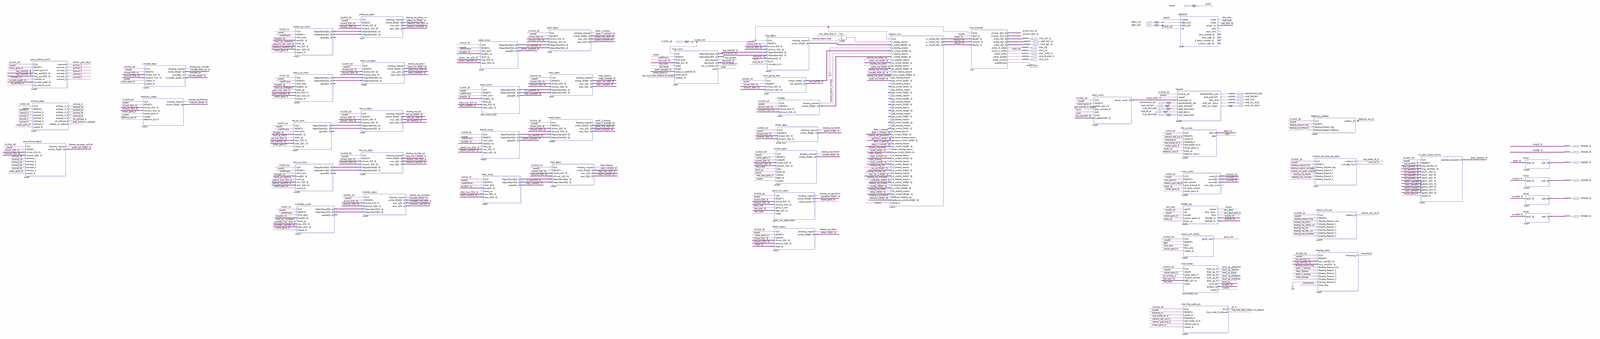
[diagram p0: schematic sheet, whole]
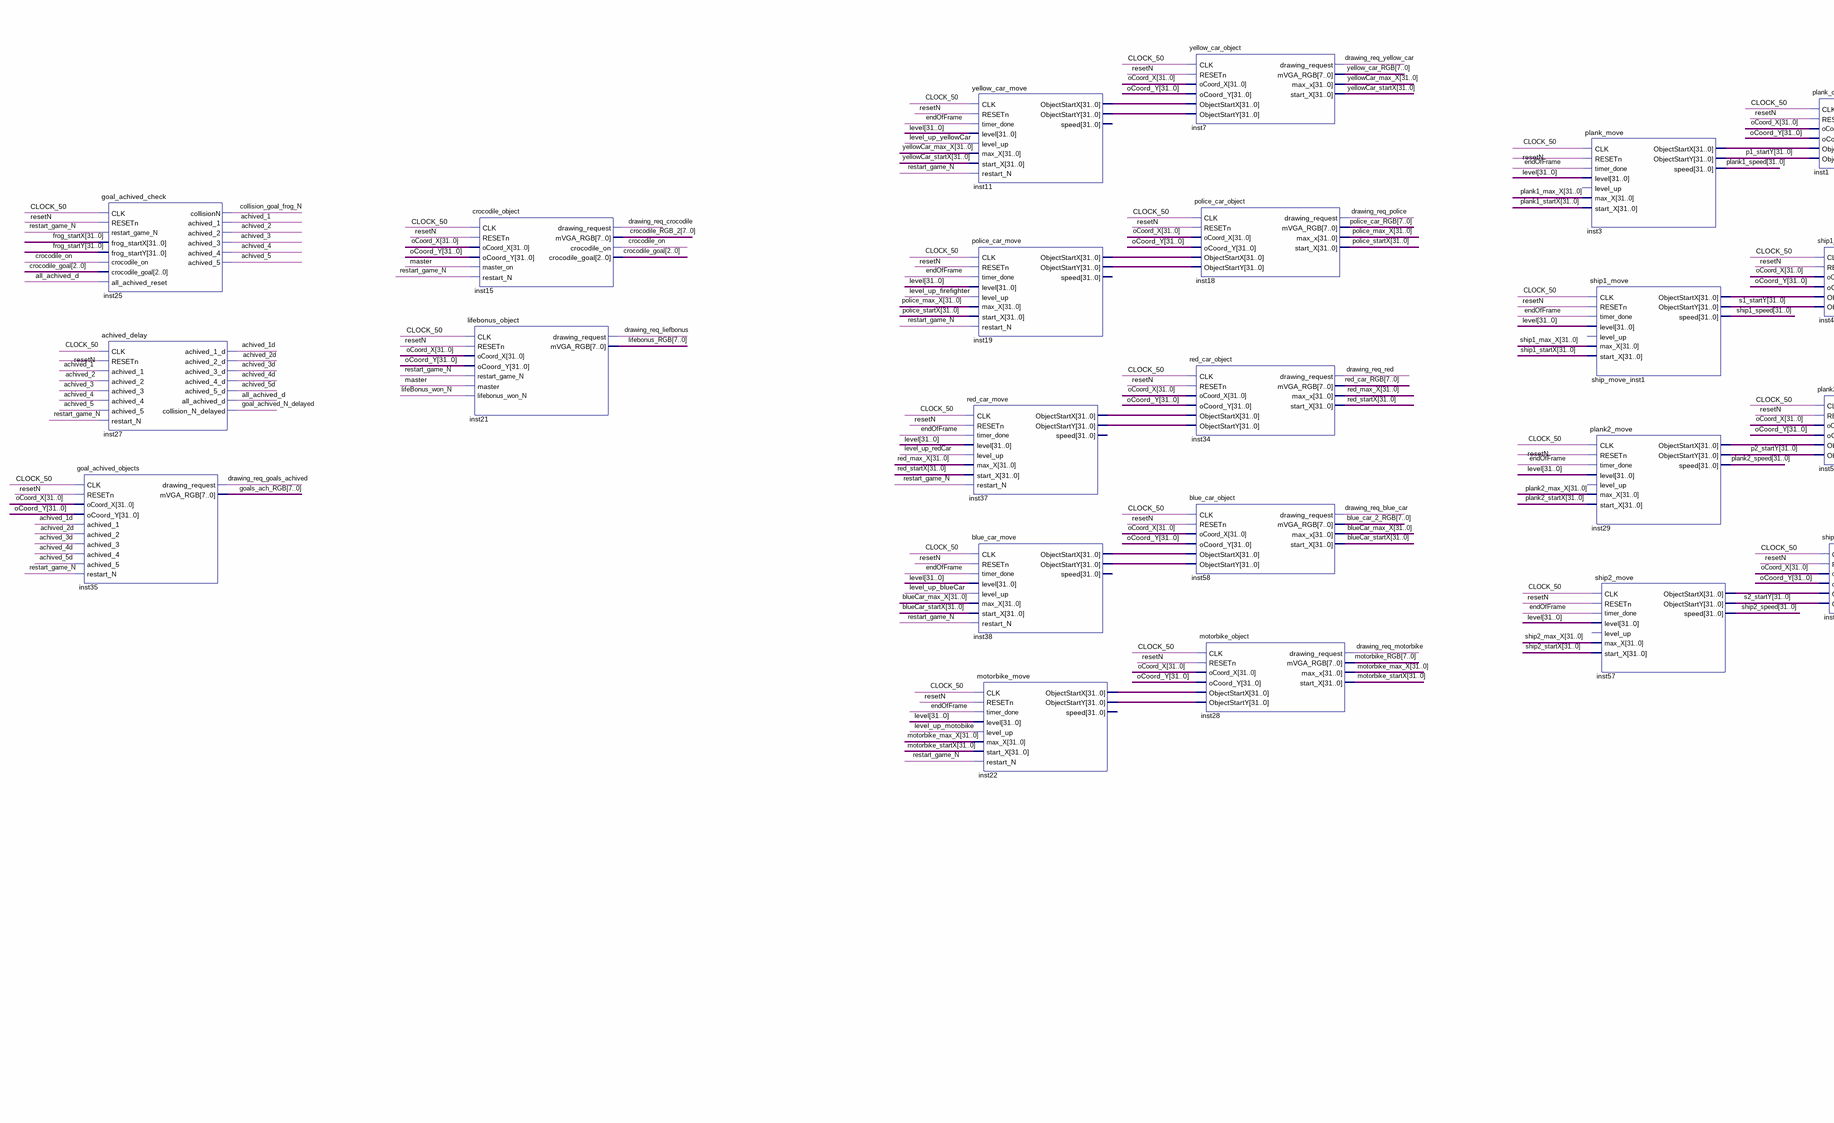
[diagram p1: schematic sheet, left part]
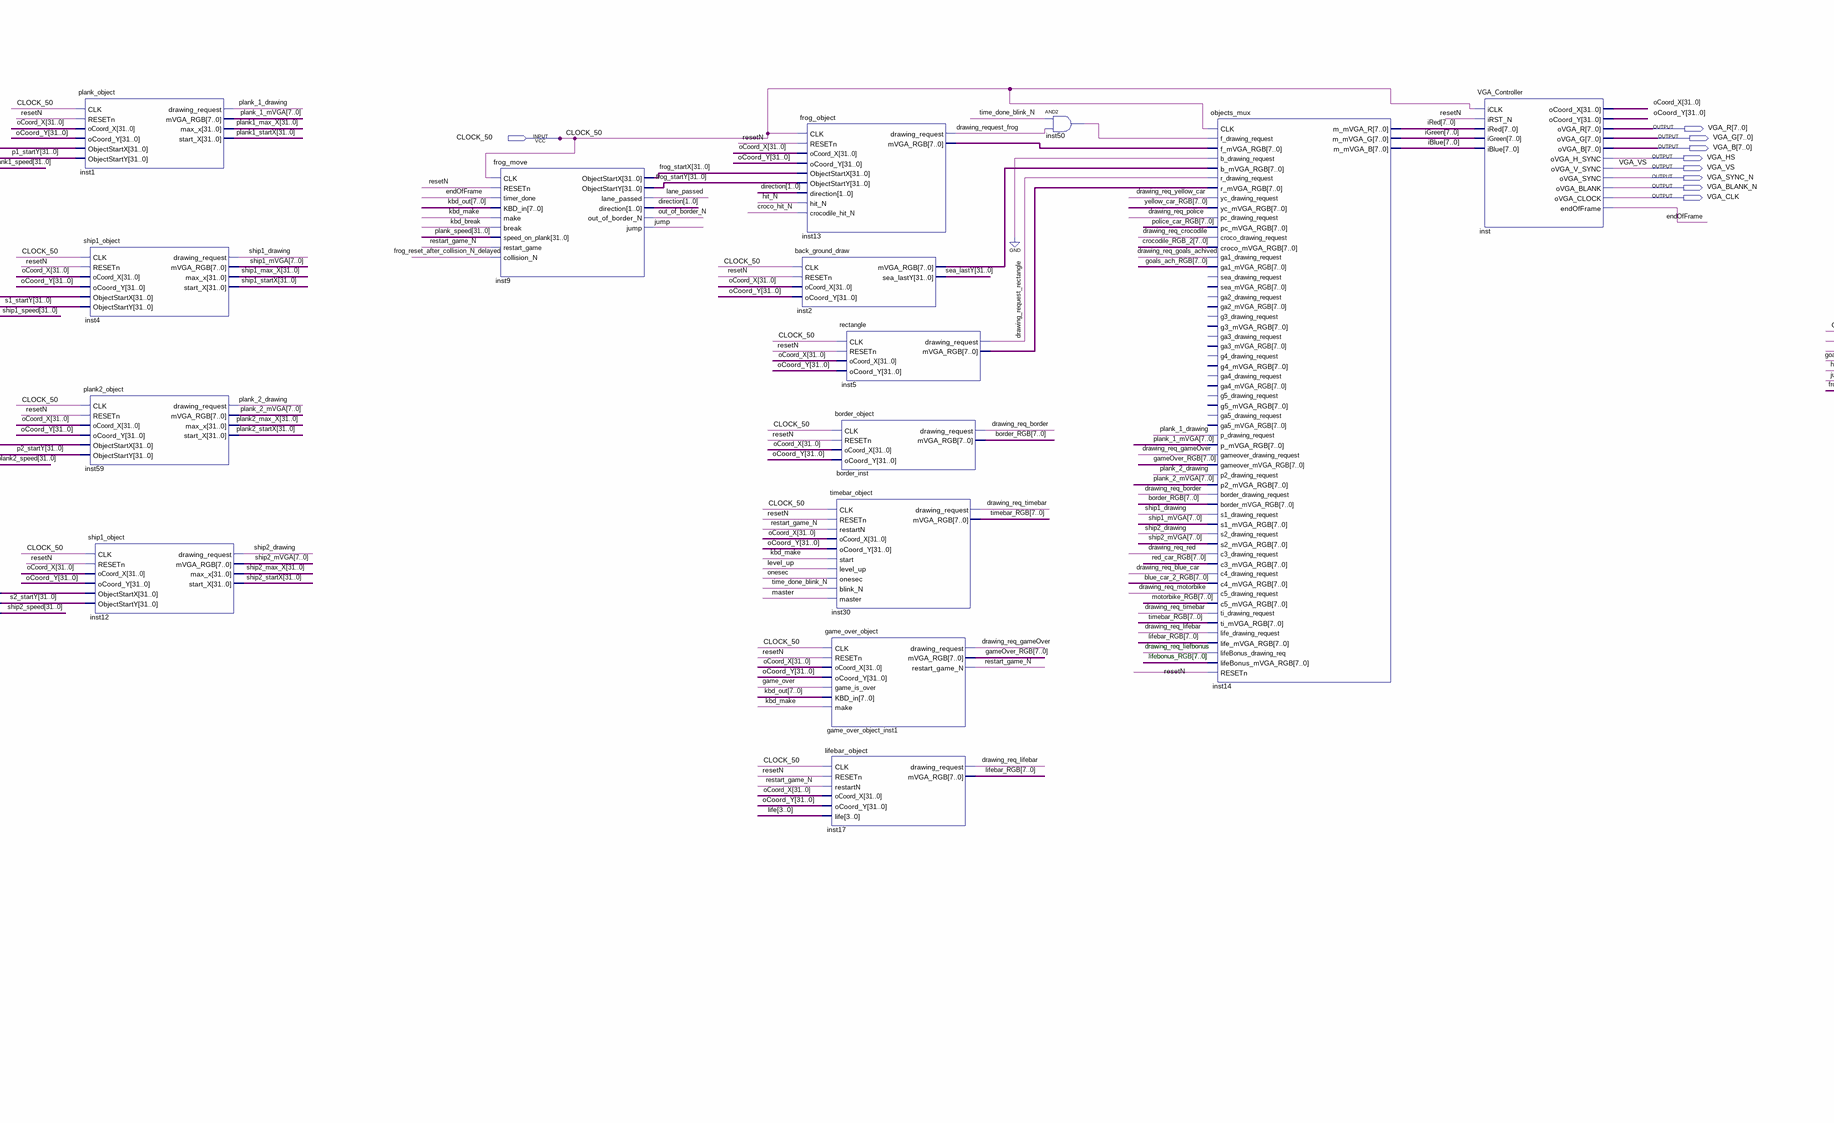
[diagram p2: schematic sheet, centre part]
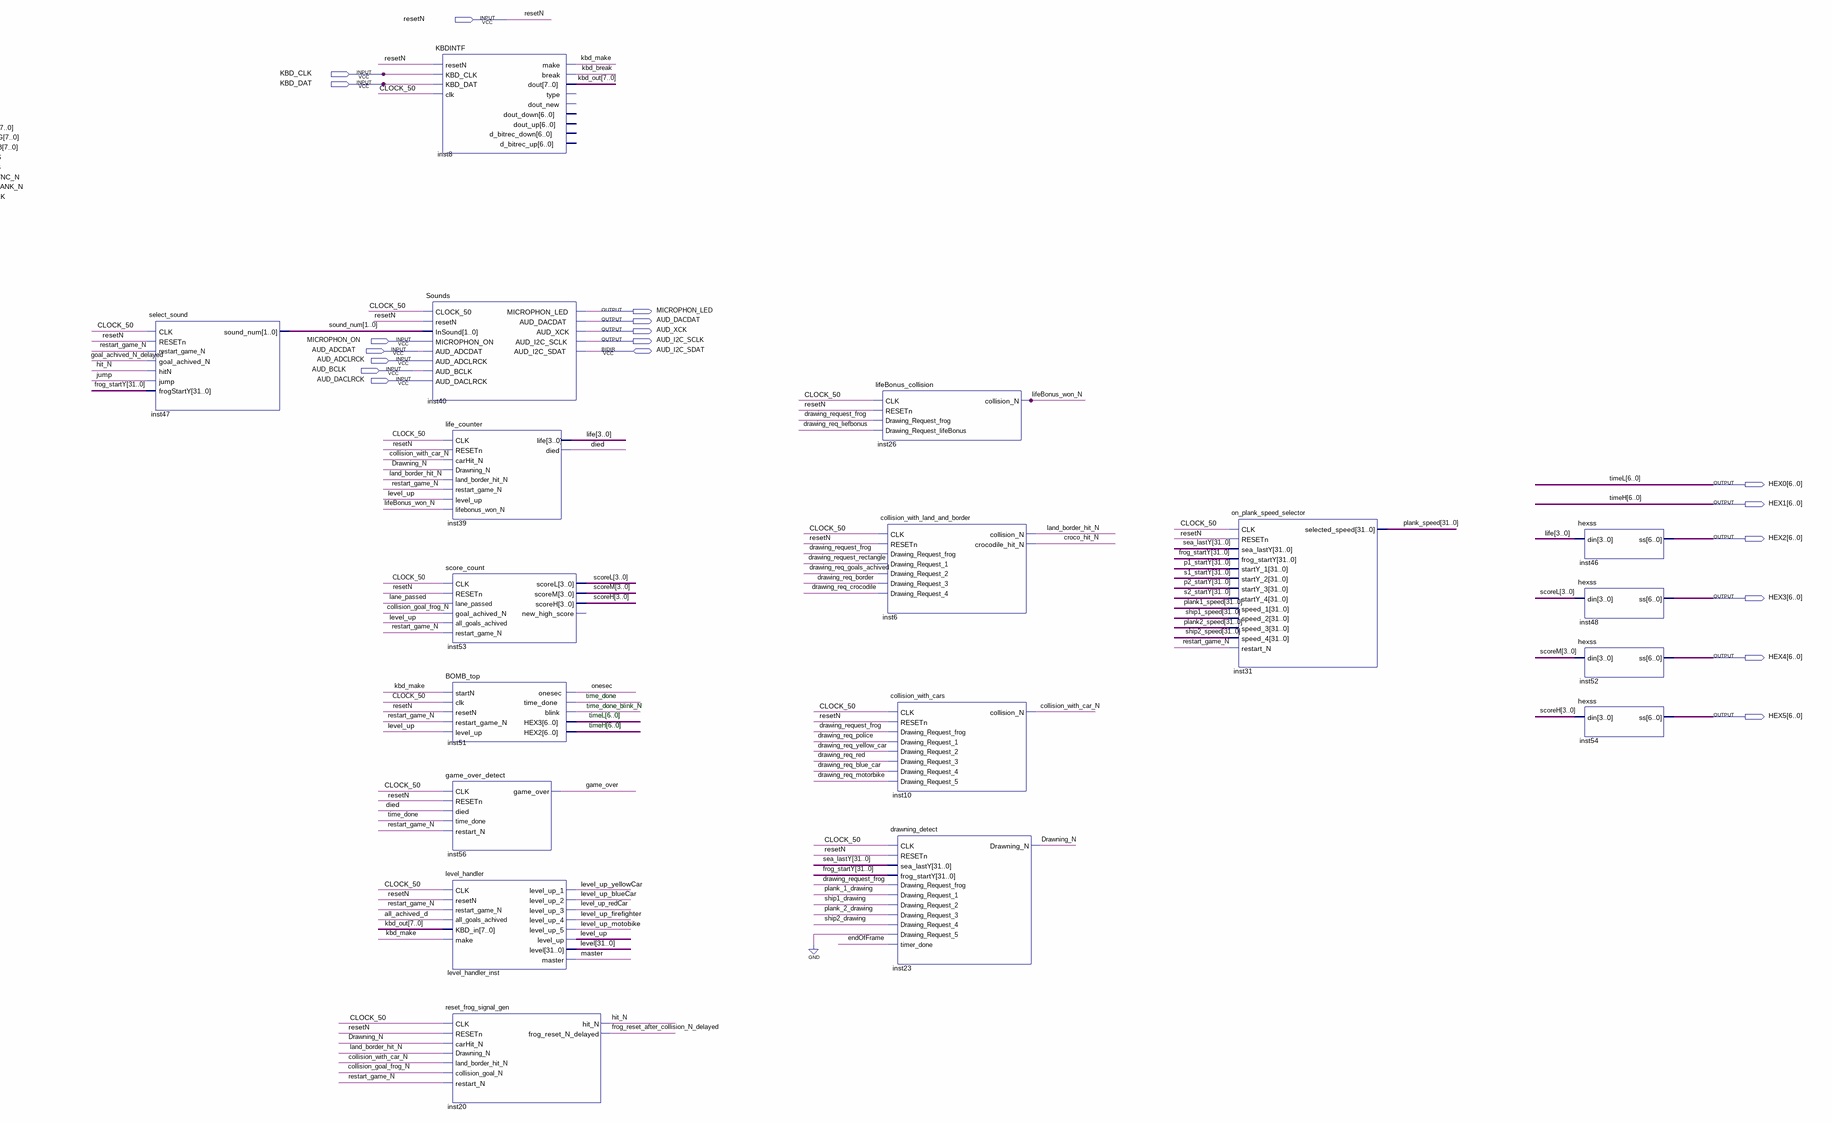
[diagram p3: schematic sheet, right part]
// Quartus schematic TOP_SIFTACH.bdf as structural Verilog: 52 symbols, 28 pins
module TOP_SIFTACH (
  input  resetN,
  input  KBD_CLK,
  input  KBD_DAT,
  input  CLOCK_50,
  input  MICROPHON_ON,
  input  AUD_ADCDAT,
  input  AUD_ADCLRCK,
  input  AUD_BCLK,
  input  AUD_DACLRCK,
  inout  AUD_I2C_SDAT,
  output [7:0] VGA_R,
  output [7:0] VGA_G,
  output [7:0] VGA_B,
  output VGA_HS,
  output VGA_VS,
  output VGA_SYNC_N,
  output VGA_BLANK_N,
  output VGA_CLK,
  output MICROPHON_LED,
  output AUD_DACDAT,
  output AUD_XCK,
  output AUD_I2C_SCLK,
  output [6:0] HEX0,
  output [6:0] HEX1,
  output [6:0] HEX2,
  output [6:0] HEX3,
  output [6:0] HEX4,
  output [6:0] HEX5
);

  wire achived_1, achived_1d, achived_2, achived_2d, achived_3, achived_3d, achived_4, achived_4d, achived_5,
       achived_5d, all_achived_d, collision_goal_frog_N, collision_with_car_N, croco_hit_N, crocodile_on,
       died, drawing_req_blue_car, drawing_req_border, drawing_req_crocodile, drawing_req_gameOver,
       drawing_req_goals_achived, drawing_req_liefbonus, drawing_req_lifebar, drawing_req_motorbike,
       drawing_req_police, drawing_req_red, drawing_req_timebar, drawing_req_yellow_car,
       drawing_request_frog, drawing_request_rectangle, Drawning_N, endOfFrame,
       frog_reset_after_collision_N_delayed, game_over, goal_achived_N_delayed, hit_N, inst50_out, jump,
       kbd_break, kbd_make, land_border_hit_N, lane_passed, level_up, level_up_blueCar, level_up_firefighter,
       level_up_motobike, level_up_redCar, level_up_yellowCar, lifeBonus_won_N, master, onesec,
       out_of_border_N, plank_1_drawing, plank_2_drawing, restart_game_N, ship1_drawing, ship2_drawing,
       time_done, time_done_blink_N;
  wire [1:0] direction, sound_num;
  wire [2:0] crocodile_goal;
  wire [3:0] life, scoreH, scoreL, scoreM;
  wire [7:0] blue_car_2_RGB, border_RGB, crocodile_RGB_2, gameOver_RGB, goals_ach_RGB, iBlue, iGreen,
       inst2_mvga_rgb, inst5_mvga_rgb, inst13_mvga_rgb, iRed, kbd_out, lifebar_RGB, lifebonus_RGB,
       motorbike_RGB, plank_1_mVGA, plank_2_mVGA, police_car_RGB, red_car_RGB, ship1_mVGA, ship2_mVGA,
       timebar_RGB, yellow_car_RGB;
  wire [31:0] blueCar_max_X, blueCar_startX, frog_startX, frog_startY, inst3_objectstartx,
       inst11_objectstartx, inst11_objectstarty, inst19_objectstartx, inst19_objectstarty,
       inst22_objectstartx, inst22_objectstarty, inst29_objectstartx, inst37_objectstartx,
       inst37_objectstarty, inst38_objectstartx, inst38_objectstarty, inst57_objectstartx, level,
       motorbike_max_X, motorbike_startX, oCoord_X, oCoord_Y, p1_startY, p2_startY, plank1_max_X,
       plank1_speed, plank1_startX, plank2_max_X, plank2_speed, plank2_startX, plank_speed, police_max_X,
       police_startX, red_max_X, red_startX, s1_startY, s2_startY, sea_lastY, ship1_max_X, ship1_speed,
       ship1_startX, ship2_max_X, ship2_speed, ship2_startX, ship_move_inst1_objectstartx, yellowCar_max_X,
       yellowCar_startX;

  goal_achived_objects inst35 (
    .CLK(CLOCK_50), .RESETn(resetN), .oCoord_X(oCoord_X), .oCoord_Y(oCoord_Y), .achived_1(achived_1d),
    .achived_2(achived_2d), .achived_3(achived_3d), .achived_4(achived_4d), .achived_5(achived_5d),
    .restart_N(restart_game_N), .drawing_request(drawing_req_goals_achived), .mVGA_RGB(goals_ach_RGB));
  goal_achived_check inst25 (
    .CLK(CLOCK_50), .RESETn(resetN), .restart_game_N(restart_game_N), .frog_startX(frog_startX),
    .frog_startY(frog_startY), .crocodile_on(crocodile_on), .crocodile_goal(crocodile_goal),
    .all_achived_reset(all_achived_d), .achived_1(achived_1), .achived_2(achived_2), .achived_3(achived_3),
    .achived_4(achived_4), .achived_5(achived_5), .collisionN(collision_goal_frog_N));
  achived_delay inst27 (
    .CLK(CLOCK_50), .RESETn(resetN), .achived_1(achived_1), .achived_2(achived_2), .achived_3(achived_3),
    .achived_4(achived_4), .achived_5(achived_5), .restart_N(restart_game_N), .achived_1_d(achived_1d),
    .achived_2_d(achived_2d), .achived_3_d(achived_3d), .achived_4_d(achived_4d), .achived_5_d(achived_5d),
    .all_achived_d(all_achived_d), .collision_N_delayed(goal_achived_N_delayed));
  crocodile_object inst15 (
    .CLK(CLOCK_50), .RESETn(resetN), .oCoord_X(oCoord_X), .oCoord_Y(oCoord_Y), .master_on(master),
    .restart_N(restart_game_N), .drawing_request(drawing_req_crocodile), .mVGA_RGB(crocodile_RGB_2),
    .crocodile_on(crocodile_on), .crocodile_goal(crocodile_goal));
  lifebonus_object inst21 (
    .CLK(CLOCK_50), .RESETn(resetN), .oCoord_X(oCoord_X), .oCoord_Y(oCoord_Y),
    .restart_game_N(restart_game_N), .master(master), .lifebonus_won_N(lifeBonus_won_N),
    .drawing_request(drawing_req_liefbonus), .mVGA_RGB(lifebonus_RGB));
  red_car_move inst37 (
    .CLK(CLOCK_50), .RESETn(resetN), .timer_done(endOfFrame), .level(level), .level_up(level_up_redCar),
    .max_X(red_max_X), .start_X(red_startX), .restart_N(restart_game_N), .ObjectStartX(inst37_objectstartx),
    .ObjectStartY(inst37_objectstarty));  // open: speed
  yellow_car_move inst11 (
    .CLK(CLOCK_50), .RESETn(resetN), .timer_done(endOfFrame), .level(level), .level_up(level_up_yellowCar),
    .max_X(yellowCar_max_X), .start_X(yellowCar_startX), .restart_N(restart_game_N),
    .ObjectStartX(inst11_objectstartx), .ObjectStartY(inst11_objectstarty));  // open: speed
  police_car_move inst19 (
    .CLK(CLOCK_50), .RESETn(resetN), .timer_done(endOfFrame), .level(level), .level_up(level_up_firefighter),
    .max_X(police_max_X), .start_X(police_startX), .restart_N(restart_game_N),
    .ObjectStartX(inst19_objectstartx), .ObjectStartY(inst19_objectstarty));  // open: speed
  blue_car_move inst38 (
    .CLK(CLOCK_50), .RESETn(resetN), .timer_done(endOfFrame), .level(level), .level_up(level_up_blueCar),
    .max_X(blueCar_max_X), .start_X(blueCar_startX), .restart_N(restart_game_N),
    .ObjectStartX(inst38_objectstartx), .ObjectStartY(inst38_objectstarty));  // open: speed
  motorbike_move inst22 (
    .CLK(CLOCK_50), .RESETn(resetN), .timer_done(endOfFrame), .level(level), .level_up(level_up_motobike),
    .max_X(motorbike_max_X), .start_X(motorbike_startX), .restart_N(restart_game_N),
    .ObjectStartX(inst22_objectstartx), .ObjectStartY(inst22_objectstarty));  // open: speed
  yellow_car_object inst7 (
    .CLK(CLOCK_50), .RESETn(resetN), .oCoord_X(oCoord_X), .oCoord_Y(oCoord_Y),
    .ObjectStartX(inst11_objectstartx), .ObjectStartY(inst11_objectstarty),
    .drawing_request(drawing_req_yellow_car), .mVGA_RGB(yellow_car_RGB), .max_x(yellowCar_max_X),
    .start_X(yellowCar_startX));
  police_car_object inst18 (
    .CLK(CLOCK_50), .RESETn(resetN), .oCoord_X(oCoord_X), .oCoord_Y(oCoord_Y),
    .ObjectStartX(inst19_objectstartx), .ObjectStartY(inst19_objectstarty),
    .drawing_request(drawing_req_police), .mVGA_RGB(police_car_RGB), .max_x(police_max_X),
    .start_X(police_startX));
  red_car_object inst34 (
    .CLK(CLOCK_50), .RESETn(resetN), .oCoord_X(oCoord_X), .oCoord_Y(oCoord_Y),
    .ObjectStartX(inst37_objectstartx), .ObjectStartY(inst37_objectstarty),
    .drawing_request(drawing_req_red), .mVGA_RGB(red_car_RGB), .max_x(red_max_X), .start_X(red_startX));
  blue_car_object inst58 (
    .CLK(CLOCK_50), .RESETn(resetN), .oCoord_X(oCoord_X), .oCoord_Y(oCoord_Y),
    .ObjectStartX(inst38_objectstartx), .ObjectStartY(inst38_objectstarty),
    .drawing_request(drawing_req_blue_car), .mVGA_RGB(blue_car_2_RGB), .max_x(blueCar_max_X),
    .start_X(blueCar_startX));
  motorbike_object inst28 (
    .CLK(CLOCK_50), .RESETn(resetN), .oCoord_X(oCoord_X), .oCoord_Y(oCoord_Y),
    .ObjectStartX(inst22_objectstartx), .ObjectStartY(inst22_objectstarty),
    .drawing_request(drawing_req_motorbike), .mVGA_RGB(motorbike_RGB), .max_x(motorbike_max_X),
    .start_X(motorbike_startX));
  plank_move inst3 (
    .CLK(CLOCK_50), .RESETn(resetN), .timer_done(endOfFrame), .level(level), .max_X(plank1_max_X),
    .start_X(plank1_startX), .ObjectStartX(inst3_objectstartx), .ObjectStartY(p1_startY), .speed(plank1_speed));  // open: level_up
  ship1_move ship_move_inst1 (
    .CLK(CLOCK_50), .RESETn(resetN), .timer_done(endOfFrame), .level(level), .max_X(ship1_max_X),
    .start_X(ship1_startX), .ObjectStartX(ship_move_inst1_objectstartx), .ObjectStartY(s1_startY),
    .speed(ship1_speed));  // open: level_up
  plank2_move inst29 (
    .CLK(CLOCK_50), .RESETn(resetN), .timer_done(endOfFrame), .level(level), .max_X(plank2_max_X),
    .start_X(plank2_startX), .ObjectStartX(inst29_objectstartx), .ObjectStartY(p2_startY),
    .speed(plank2_speed));  // open: level_up
  ship2_move inst57 (
    .CLK(CLOCK_50), .RESETn(resetN), .timer_done(endOfFrame), .level(level), .max_X(ship2_max_X),
    .start_X(ship2_startX), .ObjectStartX(inst57_objectstartx), .ObjectStartY(s2_startY), .speed(ship2_speed));  // open: level_up
  plank_object inst1 (
    .CLK(CLOCK_50), .RESETn(resetN), .oCoord_X(oCoord_X), .oCoord_Y(oCoord_Y),
    .ObjectStartX(inst3_objectstartx), .ObjectStartY(p1_startY), .drawing_request(plank_1_drawing),
    .mVGA_RGB(plank_1_mVGA), .max_x(plank1_max_X), .start_X(plank1_startX));
  ship1_object inst4 (
    .CLK(CLOCK_50), .RESETn(resetN), .oCoord_X(oCoord_X), .oCoord_Y(oCoord_Y),
    .ObjectStartX(ship_move_inst1_objectstartx), .ObjectStartY(s1_startY), .drawing_request(ship1_drawing),
    .max_x(ship1_max_X), .start_X(ship1_startX), .mVGA_RGB(ship1_mVGA));
  plank2_object inst59 (
    .CLK(CLOCK_50), .RESETn(resetN), .oCoord_X(oCoord_X), .oCoord_Y(oCoord_Y),
    .ObjectStartX(inst29_objectstartx), .ObjectStartY(p2_startY), .drawing_request(plank_2_drawing),
    .mVGA_RGB(plank_2_mVGA), .max_x(plank2_max_X), .start_X(plank2_startX));
  ship1_object inst12 (
    .CLK(CLOCK_50), .RESETn(resetN), .oCoord_X(oCoord_X), .oCoord_Y(oCoord_Y),
    .ObjectStartX(inst57_objectstartx), .ObjectStartY(s2_startY), .drawing_request(ship2_drawing),
    .max_x(ship2_max_X), .start_X(ship2_startX), .mVGA_RGB(ship2_mVGA));
  frog_move inst9 (
    .CLK(CLOCK_50), .RESETn(resetN), .timer_done(endOfFrame), .KBD_in(kbd_out), .make(kbd_make),
    .\break (kbd_break), .speed_on_plank(plank_speed), .restart_game(restart_game_N),
    .collision_N(frog_reset_after_collision_N_delayed), .ObjectStartX(frog_startX),
    .ObjectStartY(frog_startY), .lane_passed(lane_passed), .direction(direction), .jump(jump),
    .out_of_border_N(out_of_border_N));
  frog_object inst13 (
    .CLK(CLOCK_50), .RESETn(resetN), .oCoord_X(oCoord_X), .oCoord_Y(oCoord_Y), .ObjectStartX(frog_startX),
    .ObjectStartY(frog_startY), .direction(direction), .hit_N(hit_N), .crocodile_hit_N(croco_hit_N),
    .drawing_request(drawing_request_frog), .mVGA_RGB(inst13_mvga_rgb));
  back_ground_draw inst2 (
    .CLK(CLOCK_50), .RESETn(resetN), .oCoord_X(oCoord_X), .oCoord_Y(oCoord_Y), .mVGA_RGB(inst2_mvga_rgb),
    .sea_lastY(sea_lastY));
  rectangle inst5 (
    .CLK(CLOCK_50), .RESETn(resetN), .oCoord_X(oCoord_X), .oCoord_Y(oCoord_Y),
    .drawing_request(drawing_request_rectangle), .mVGA_RGB(inst5_mvga_rgb));
  border_object border_inst (
    .CLK(CLOCK_50), .RESETn(resetN), .oCoord_X(oCoord_X), .oCoord_Y(oCoord_Y),
    .drawing_request(drawing_req_border), .mVGA_RGB(border_RGB));
  timebar_object inst30 (
    .CLK(CLOCK_50), .RESETn(resetN), .restartN(restart_game_N), .oCoord_X(oCoord_X), .oCoord_Y(oCoord_Y),
    .start(kbd_make), .level_up(level_up), .onesec(onesec), .blink_N(time_done_blink_N), .master(master),
    .drawing_request(drawing_req_timebar), .mVGA_RGB(timebar_RGB));
  game_over_object game_over_object_inst1 (
    .CLK(CLOCK_50), .RESETn(resetN), .oCoord_X(oCoord_X), .oCoord_Y(oCoord_Y), .game_is_over(game_over),
    .KBD_in(kbd_out), .make(kbd_make), .drawing_request(drawing_req_gameOver), .mVGA_RGB(gameOver_RGB),
    .restart_game_N(restart_game_N));
  lifebar_object inst17 (
    .CLK(CLOCK_50), .RESETn(resetN), .restartN(restart_game_N), .oCoord_X(oCoord_X), .oCoord_Y(oCoord_Y),
    .life(life), .drawing_request(drawing_req_lifebar), .mVGA_RGB(lifebar_RGB));
  and inst50 (inst50_out, time_done_blink_N, drawing_request_frog);
  objects_mux inst14 (
    .CLK(CLOCK_50), .f_drawing_request(inst50_out), .f_mVGA_RGB(inst13_mvga_rgb), .b_drawing_request(1'b0),
    .b_mVGA_RGB(inst2_mvga_rgb), .r_drawing_request(drawing_request_rectangle), .r_mVGA_RGB(inst5_mvga_rgb),
    .yc_drawing_request(drawing_req_yellow_car), .yc_mVGA_RGB(yellow_car_RGB),
    .pc_drawing_request(drawing_req_police), .pc_mVGA_RGB(police_car_RGB),
    .croco_drawing_request(drawing_req_crocodile), .croco_mVGA_RGB(crocodile_RGB_2),
    .ga1_drawing_request(drawing_req_goals_achived), .ga1_mVGA_RGB(goals_ach_RGB),
    .p_drawing_request(plank_1_drawing), .p_mVGA_RGB(plank_1_mVGA),
    .gameover_drawing_request(drawing_req_gameOver), .gameover_mVGA_RGB(gameOver_RGB),
    .p2_drawing_request(plank_2_drawing), .p2_mVGA_RGB(plank_2_mVGA),
    .border_drawing_request(drawing_req_border), .border_mVGA_RGB(border_RGB),
    .s1_drawing_request(ship1_drawing), .s1_mVGA_RGB(ship1_mVGA), .s2_drawing_request(ship2_drawing),
    .s2_mVGA_RGB(ship2_mVGA), .c3_drawing_request(drawing_req_red), .c3_mVGA_RGB(red_car_RGB),
    .c4_drawing_request(drawing_req_blue_car), .c4_mVGA_RGB(blue_car_2_RGB),
    .c5_drawing_request(drawing_req_motorbike), .c5_mVGA_RGB(motorbike_RGB),
    .ti_drawing_request(drawing_req_timebar), .ti_mVGA_RGB(timebar_RGB),
    .life_drawing_request(drawing_req_lifebar), .life_mVGA_RGB(lifebar_RGB),
    .lifeBonus_drawing_req(drawing_req_liefbonus), .lifeBonus_mVGA_RGB(lifebonus_RGB), .RESETn(resetN),
    .m_mVGA_R(iRed), .m_mVGA_G(iGreen), .m_mVGA_B(iBlue));  // open: sea_drawing_request, sea_mVGA_RGB, ga2_drawing_request, ga2_mVGA_RGB, g3_drawing_request, g3_mVGA_RGB, ga3_drawing_request, ga3_mVGA_RGB, g4_drawing_request, g4_mVGA_RGB, ga4_drawing_request, ga4_mVGA_RGB, g5_drawing_request, g5_mVGA_RGB, ga5_drawing_request, ga5_mVGA_RGB
  VGA_Controller inst (
    .iCLK(CLOCK_50), .iRST_N(resetN), .iRed(iRed), .iGreen(iGreen), .iBlue(iBlue), .oCoord_X(oCoord_X),
    .oCoord_Y(oCoord_Y), .oVGA_R(VGA_R), .oVGA_G(VGA_G), .oVGA_B(VGA_B), .oVGA_H_SYNC(VGA_HS),
    .oVGA_V_SYNC(VGA_VS), .oVGA_SYNC(VGA_SYNC_N), .oVGA_BLANK(VGA_BLANK_N), .oVGA_CLOCK(VGA_CLK),
    .endOfFrame(endOfFrame));
  select_sound inst47 (
    .CLK(CLOCK_50), .RESETn(resetN), .restart_game_N(restart_game_N),
    .goal_achived_N(goal_achived_N_delayed), .hitN(hit_N), .jump(jump), .frogStartY(frog_startY),
    .sound_num(sound_num));
  Sounds inst40 (
    .CLOCK_50(CLOCK_50), .resetN(resetN), .InSound(sound_num), .MICROPHON_ON(MICROPHON_ON),
    .AUD_ADCDAT(AUD_ADCDAT), .AUD_ADCLRCK(AUD_ADCLRCK), .AUD_BCLK(AUD_BCLK), .AUD_DACLRCK(AUD_DACLRCK),
    .MICROPHON_LED(MICROPHON_LED), .AUD_DACDAT(AUD_DACDAT), .AUD_XCK(AUD_XCK), .AUD_I2C_SCLK(AUD_I2C_SCLK),
    .AUD_I2C_SDAT(AUD_I2C_SDAT));
  KBDINTF inst8 (
    .resetN(resetN), .KBD_CLK(KBD_CLK), .KBD_DAT(KBD_DAT), .clk(CLOCK_50), .make(kbd_make),
    .\break (kbd_break), .dout(kbd_out));  // open: type, dout_new, dout_down, dout_up, d_bitrec_down, d_bitrec_up
  life_counter inst39 (
    .CLK(CLOCK_50), .RESETn(resetN), .carHit_N(collision_with_car_N), .Drawning_N(Drawning_N),
    .land_border_hit_N(land_border_hit_N), .restart_game_N(restart_game_N), .level_up(level_up),
    .lifebonus_won_N(lifeBonus_won_N), .life(life), .died(died));
  score_count inst53 (
    .CLK(CLOCK_50), .RESETn(resetN), .lane_passed(lane_passed), .goal_achived_N(collision_goal_frog_N),
    .all_goals_achived(level_up), .restart_game_N(restart_game_N), .scoreL(scoreL), .scoreM(scoreM),
    .scoreH(scoreH));  // open: new_high_score
  BOMB_top inst51 (
    .startN(kbd_make), .clk(CLOCK_50), .resetN(resetN), .restart_game_N(restart_game_N), .level_up(level_up),
    .onesec(onesec), .time_done(time_done), .blink(time_done_blink_N), .HEX3(HEX0), .HEX2(HEX1));
  game_over_detect inst56 (
    .CLK(CLOCK_50), .RESETn(resetN), .died(died), .time_done(time_done), .restart_N(restart_game_N),
    .game_over(game_over));
  level_handler level_handler_inst (
    .CLK(CLOCK_50), .resetN(resetN), .restart_game_N(restart_game_N), .all_goals_achived(all_achived_d),
    .KBD_in(kbd_out), .make(kbd_make), .level(level), .master(master), .level_up_1(level_up_yellowCar),
    .level_up_2(level_up_blueCar), .level_up_3(level_up_redCar), .level_up_4(level_up_firefighter),
    .level_up_5(level_up_motobike), .level_up(level_up));
  reset_frog_signal_gen inst20 (
    .CLK(CLOCK_50), .RESETn(resetN), .carHit_N(Drawning_N), .Drawning_N(land_border_hit_N),
    .land_border_hit_N(collision_with_car_N), .collision_goal_N(collision_goal_frog_N),
    .restart_N(restart_game_N), .hit_N(hit_N), .frog_reset_N_delayed(frog_reset_after_collision_N_delayed));
  lifeBonus_collision inst26 (
    .CLK(CLOCK_50), .RESETn(resetN), .Drawing_Request_frog(drawing_request_frog),
    .Drawing_Request_lifeBonus(drawing_req_liefbonus), .collision_N(lifeBonus_won_N));
  collision_with_land_and_border inst6 (
    .CLK(CLOCK_50), .RESETn(resetN), .Drawing_Request_frog(drawing_request_frog),
    .Drawing_Request_1(drawing_request_rectangle), .Drawing_Request_2(drawing_req_goals_achived),
    .Drawing_Request_3(drawing_req_border), .Drawing_Request_4(drawing_req_crocodile),
    .crocodile_hit_N(croco_hit_N), .collision_N(land_border_hit_N));
  collision_with_cars inst10 (
    .CLK(CLOCK_50), .RESETn(resetN), .Drawing_Request_frog(drawing_request_frog),
    .Drawing_Request_1(drawing_req_police), .Drawing_Request_2(drawing_req_yellow_car),
    .Drawing_Request_3(drawing_req_red), .Drawing_Request_4(drawing_req_blue_car),
    .Drawing_Request_5(drawing_req_motorbike), .collision_N(collision_with_car_N));
  drawning_detect inst23 (
    .CLK(CLOCK_50), .RESETn(resetN), .sea_lastY(sea_lastY), .frog_startY(frog_startY),
    .Drawing_Request_frog(drawing_request_frog), .Drawing_Request_1(plank_1_drawing),
    .Drawing_Request_2(ship1_drawing), .Drawing_Request_3(plank_2_drawing),
    .Drawing_Request_4(ship2_drawing), .Drawing_Request_5(1'b0), .timer_done(endOfFrame),
    .Drawning_N(Drawning_N));
  on_plank_speed_selector inst31 (
    .CLK(CLOCK_50), .RESETn(resetN), .sea_lastY(sea_lastY), .frog_startY(frog_startY), .startY_1(p1_startY),
    .startY_2(s1_startY), .startY_3(p2_startY), .startY_4(s2_startY), .speed_1(plank1_speed),
    .speed_2(ship1_speed), .speed_3(plank2_speed), .speed_4(ship2_speed), .restart_N(restart_game_N),
    .selected_speed(plank_speed));
  hexss inst46 (.din(life), .ss(HEX2));
  hexss inst48 (.din(scoreL), .ss(HEX3));
  hexss inst52 (.din(scoreM), .ss(HEX4));
  hexss inst54 (.din(scoreH), .ss(HEX5));

  // Other names for the same wires on the sheet: timeH[6:0] = HEX1; timeL[6:0] = HEX0

  // Notes on the sheet:
  //   drawing_req_liefbonus
  //   lifebonus_RGB[7..0]
  //   time_done
  //   time_done_blink_N
  //   timeL[6..0]
  //   timeH[6..0]
endmodule
